# EAGLE design Interface Board v1.2 (EAGLE 9.5.1)
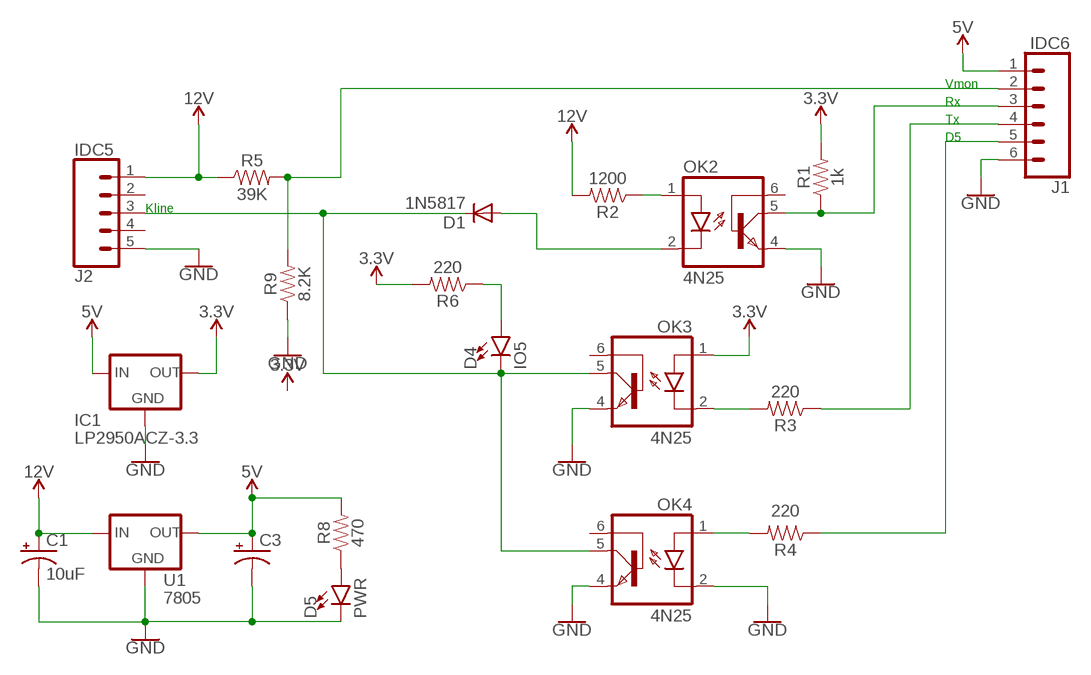
[diagram p0: schematic, sheet 1]

## Parts
C1  10uF  10UF-POLAR-RADIAL-2.5MM-25V-20%  [CPOL-RADIAL-2.5MM-5MM]
C3  10uF  10UF-POLAR-RADIAL-2.5MM-25V-20%  [CPOL-RADIAL-2.5MM-5MM]
D1  1N5817  1N4004  [DO41-10]
D4  IO5  LED5MM  [LED_5MM]
D5  PWR  LED5MM  [LED_5MM]
IC1  LP2950ACZ-3.3  [TO92]
J1  IDC6  CONN_06LONGPADS  [1X06_LONGPADS]
J2  IDC5  CONN_05  [1X05]
OK2  4N25  4N35  [DIL06]
OK3  4N25  4N35  [DIL06]
OK4  4N25  4N35  [DIL06]
R1  1k  1KOHM-HORIZ-1/4W-1%  [AXIAL-0.3]
R2  1200  1KOHM-HORIZ-1/4W-1%  [AXIAL-0.3]
R3  220  1KOHM-HORIZ-1/4W-1%  [AXIAL-0.3]
R4  220  1KOHM-HORIZ-1/4W-1%  [AXIAL-0.3]
R5  39K  1KOHM-HORIZ-1/4W-1%  [AXIAL-0.3]
R6  220  1KOHM-HORIZ-1/4W-1%  [AXIAL-0.3]
R8  470  1KOHM-HORIZ-1/4W-1%  [AXIAL-0.3]
R9  8.2K  1KOHM-HORIZ-1/4W-1%  [AXIAL-0.3]
U1  7805  V_REG_78XX-TO-220  [TO-220-ALT]

## Nets
3.3V: IC1.1(OUT) OK3.1(A) R1.P$2 R6.P$2
5V: C3.1(+) IC1.3(IN) J1.1 R8.P$2 U1.OUT
12V: C1.1(+) J2.1 R2.P$2 R5.P$1 U1.IN
GND: C1.2(-) C3.2(-) D5.K(C) IC1.2(GND) J1.6 J2.5 OK2.4(EMI) OK3.4(EMI) OK4.2(C) OK4.4(EMI) R9.P$1 U1.GND
KLINE: D1.C D4.K(C) J2.3 OK3.5(COL) OK4.5(COL)
N$1: OK3.2(C) R3.P$2
N$2: J1.4 R3.P$1
N$3: D1.A OK2.2(C)
N$5: D4.A R6.P$1
N$7: J1.3 OK2.5(COL) R1.P$1
N$8: OK2.1(A) R2.P$1
N$9: D5.A R8.P$1
N$10: J1.5 R4.P$1
N$11: OK4.1(A) R4.P$2
VMON: J1.2 R5.P$2 R9.P$2
Unconnected: J2.2 J2.4 OK2.6(BAS) OK3.6(BAS) OK4.6(BAS)

## Notes on the sheet
- Vmon
- Rx
- Tx
- D5
- Kline

## Library data of the parts
C1 C3 = SparkFun-Capacitors:10UF-POLAR: 10.0µF polarized capacitors A capacitor is a passive two-terminal electrical component used to store electrical energy temporarily in an electric field.; PROD_ID: CAP-08440
D1 = adafruit:1N4004: DIODE General purpose 1N400x type rectifier (With bigger pads) http://www.ladyada.net/library/pcb/eaglelibrary.html
D4 D5 = Modified-SF-LED-RGB-CA:LED: LED (Generic) Standard schematic elements and footprints for 5mm, 3mm, 1206, and 0603 sized LEDs. Generic LEDs with no color specified.
IC1 = v-reg:LP2950?*: Source: http://cache.national.com/ds/LP/LP2950.pdf
J1 = SparkFun-Connectors:CONN_06: Multi connection point. Often used as Generic Header-pin footprint for 0.1 inch spaced/style header connections On any of the 0.1 inch spaced packages, you can populate with these: Break Away Headers - Straight <https://www.sparkfun.com/products/116> (PRT-00116) Break Away Male Headers - Right Angle <https://www.sparkfun.com/products/553> (PRT-00553) Female Headers <https://www.sparkfun.com/products/115> (PRT-00115) Break Away Headers - Machine Pin <https://www.sparkfun.com/products/117> (PRT-00117) Break Away Female Headers - Swiss Machine Pin <https://www.sparkfun.com/products/743> (PRT-00743) Arduino Stackable Header - 6 Pin <https://www.sparkfun.com/products/9280> (PRT-09280) For SCREWTERMINALS and SPRING TERMINALS visit here: Screw Terimnals on SparkFun.com <https://www.sparkfun.com/search/results?term=Screw+Terminals> (5mm/3.5mm/2.54mm spacing) This device is also useful as a general connection point to wire up your design to another part of your project. Our various solder wires solder well into these plated through hole pads. Hook-Up Wire - Assortment (Stranded, 22 AWG) <https://www.sparkfun.com/products/11375> (PRT-11375) Hook-Up Wire - Assortment (Solid Core, 22 AWG) <https://www.sparkfun.com/products/11367> (PRT-11367) View the entire wire category on our website here <https://www.sparkfun.com/categories/141>
J2 = SparkFun-Connectors:CONN_05: Multi connection point. Often used as Generic Header-pin footprint for 0.1 inch spaced/style header connections On any of the 0.1 inch spaced packages, you can populate with these: Break Away Headers - Straight <https://www.sparkfun.com/products/116> (PRT-00116) Break Away Male Headers - Right Angle <https://www.sparkfun.com/products/553> (PRT-00553) Female Headers <https://www.sparkfun.com/products/115> (PRT-00115) Break Away Headers - Machine Pin <https://www.sparkfun.com/products/117> (PRT-00117) Break Away Female Headers - Swiss Machine Pin <https://www.sparkfun.com/products/743> (PRT-00743) For SCREWTERMINALS and SPRING TERMINALS visit here: Screw Terimnals on SparkFun.com <https://www.sparkfun.com/search/results?term=Screw+Terminals> (5mm/3.5mm/2.54mm spacing) This device is also useful as a general connection point to wire up your design to another part of your project. Our various solder wires solder well into these plated through hole pads. Hook-Up Wire - Assortment (Stranded, 22 AWG) <https://www.sparkfun.com/products/11375> (PRT-11375) Hook-Up Wire - Assortment (Solid Core, 22 AWG) <https://www.sparkfun.com/products/11367> (PRT-11367) View the entire wire category on our website here <https://www.sparkfun.com/categories/141> Special notes: Molex polarized connector foot print use with SKU : PRT-08231 with associated crimp pins and housings. 1MM SMD Version SKU: PRT-10208
OK2-OK4 = optocoupler:4N35: MOTOROLA OPTO COUPLER; MF: FAIRCHILD SEMICONDUCTOR; MPN: 4N35; OC_FARNELL: 1328375; OC_NEWARK: 72K9946
R1 = SparkFun-Resistors:1KOHM: 1kΩ resistor A resistor is a passive two-terminal electrical component that implements electrical resistance as a circuit element. Resistors act to reduce current flow, and, at the same time, act to lower voltage levels within circuits. - Wikipedia; PROD_ID: RES-12182
R2-R6 R8 R9 = SparkFun-Resistors:1KOHM: 1kΩ resistor A resistor is a passive two-terminal electrical component that implements electrical resistance as a circuit element. Resistors act to reduce current flow, and, at the same time, act to lower voltage levels within circuits. - Wikipedia; PROD_ID: RES-12182; VALUE: 1k
U1 = SparkFun-IC-Power:V_REG_78XX: Voltage Regulator Standard 78xx regulator. IGO (Input Ground Output). Spark Fun Electronics SKU : COM-00107; PROD_ID: VREG-08450; SF_ID: COM-00107

## Board
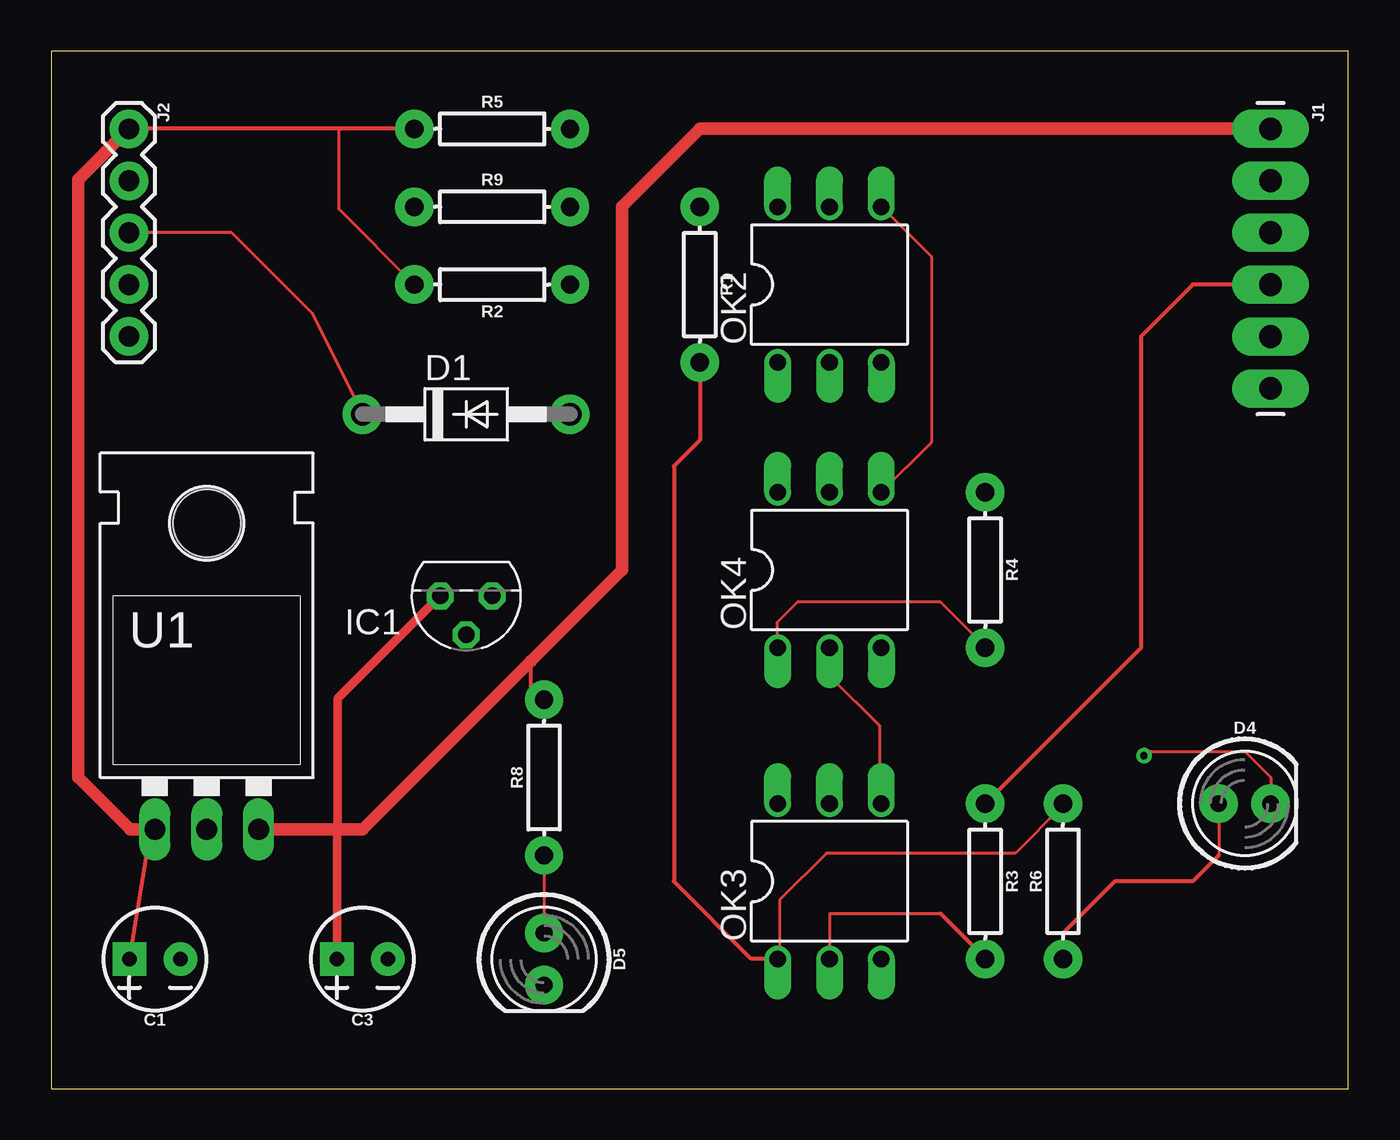
[diagram p1: board, top side]
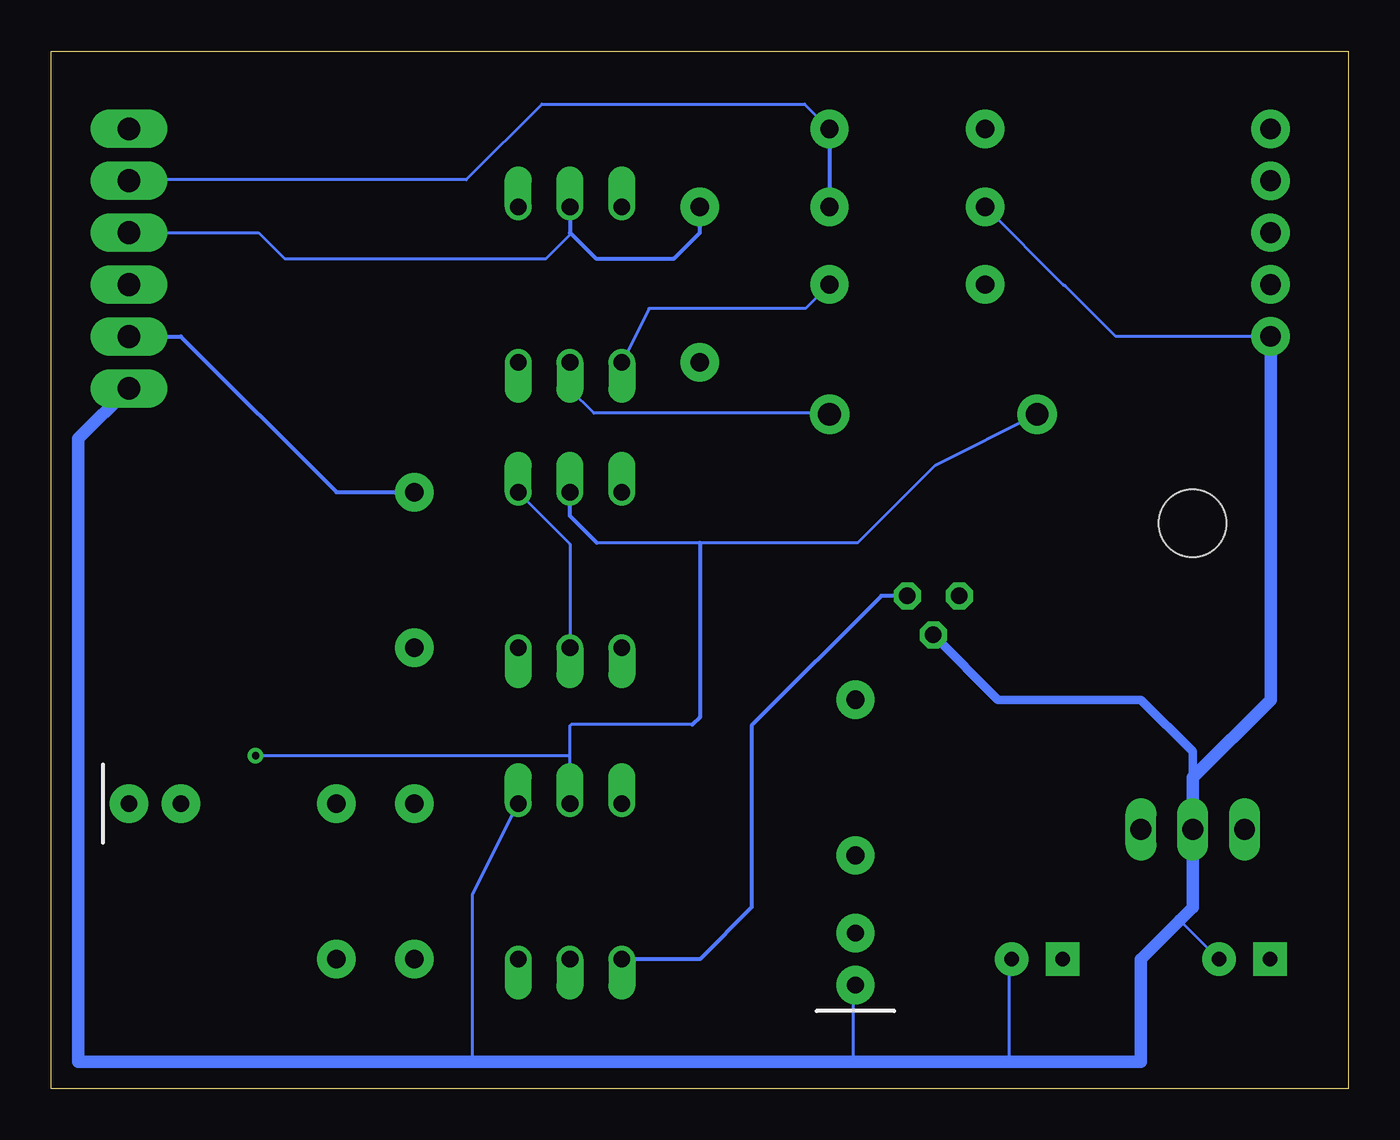
[diagram p2: board, bottom side, seen from below]

Size 63.5 x 50.8 mm. Coordinates in mm from the lower left corner, seen from the top.
Outline: 0,0 63.5,0 63.5,50.8 0,50.8 0,0
Copper layers (1*16): Top 0.035mm / dielectric 1.5mm / Bottom 0.035mm
Design rules "default": minimum track width 6mil, minimum drill 0.35mm, track to track 6mil, track to pad 6mil, pad to pad 6mil, via to via 6mil, smd to smd 6mil, copper to edge 40mil, drill to drill 6mil, minimum pad ring 10mil, minimum via ring 8mil, stop-mask expansion 4mil, vias tented up to drill 0mil, thermal gap 10mil

### Footprints (pad centres in the part's own frame; a part is rotated, then mirrored left to right if it is on the bottom)
CPOL-RADIAL-2.5MM-5MM = drill 0.7 pad 1.651 square: 1 1.25,0 | drill 0.7 pad 1.651: 2 -1.25,0
DO41-10 = drill 1.118 pad 1.93: A 5.08,0; C -5.08,0
LED_5MM = drill 0.813 pad 1.88: A -1.27,0; K 1.27,0
TO92 = drill 0.813 octagon: 1 -1.27,0; 2 0,1.905; 3 1.27,0
1X06_LONGPADS = drill 1.118 pad 1.88 long: 1 0,0; 2 2.54,0; 3 5.08,0; 4 7.62,0; 5 10.16,0; 6 12.7,0
1X05 = drill 1.016 pad 1.88: 1 0,0; 2 2.54,0; 3 5.08,0; 4 7.62,0; 5 10.16,0
DIL06 = drill 0.813 offset: 1 -2.54,-3.81; 2 0,-3.81; 3 2.54,-3.81; 4 2.54,3.81; 5 0,3.81; 6 -2.54,3.81
AXIAL-0.3 = drill 0.9 pad 1.88: P$1 -3.81,0; P$2 3.81,0
TO-220-ALT = drill 1.016 long: GND 0,-3.81; IN -2.54,-3.81; OUT 2.54,-3.81 | hole 3.302: 0,11.176

### Placement (x,y rotation side)
C1  5.08,6.35 180 top
C3  15.24,6.35 180 top
D1  20.32,33.02 0 top
D4  58.42,13.97 0 top
D5  24.13,6.35 270 top
IC1  20.32,24.13 180 top
J1  59.69,46.99 270 top
J2  3.81,46.99 270 top
OK2  38.1,39.37 0 top
OK3  38.1,10.16 0 top
OK4  38.1,25.4 0 top
R1  31.75,39.37 270 top
R2  21.59,39.37 180 top
R3  45.72,10.16 270 top
R4  45.72,25.4 270 top
R5  21.59,46.99 0 top
R6  49.53,10.16 90 top
R8  24.13,15.24 90 top
R9  21.59,43.18 0 top
U1  7.62,16.51 0 top

### Tracks (layer width: path | path; a pad name or v marks a point on that pad's centre or on a via)
3.3V
  Top 0.152: OK3.1 35.66,6.4 35.66,9.25 37.95,11.53 47.19,11.53 49.53,13.87 R6.P$2
  Top 0.203: R1.P$2 31.75,31.75 30.48,30.48 30.48,10.16 34.24,6.4 35.66,6.4
  Bottom 0.203: IC1.1 22.86,24.13 29.21,17.78 29.21,8.89 31.75,6.35 OK3.1
5V
  Top 0.203: R8.P$2 23.5,19.68 23.5,20.95
  Top 0.406: IC1.3 14.02,19.1 14.02,12.7 13.99,12.67 C3.1
  Top 0.61: J1.1 31.75,46.99 27.94,43.18 27.94,25.4 23.5,20.95 15.24,12.7 14.02,12.7 U1.OUT
12V
  Top 0.152: R2.P$2 14.07,43.08 14.07,46.99
  Top 0.203: R5.P$1 14.07,46.99 J2.1 | U1.IN 4.83,12.45 C1.1
  Top 0.61: J2.1 1.32,44.5 1.32,15.24 3.86,12.7 U1.IN
GND
  Top 0.152: OK3.4 40.54,14.02 40.54,17.78 38.1,20.22 OK4.2 | OK2.4 43.08,40.74 43.08,31.65 OK4.4
  Bottom 0.152: OK4.2 38.1,26.67 OK4.4 | J2.5 11.38,36.83 13.87,39.32 13.97,39.37 R9.P$1 | 42.88,1.32 42.88,9.5 OK3.4 | 24.23,1.32 24.23,5.08 D5.K | 8.26,8.26 6.4,6.4 C1.2 | 16.61,1.32 16.61,6.25 C3.2
  Bottom 0.406: IC1.2 17.14,19.05 10.16,19.05 7.62,16.51 7.62,15.24
  Bottom 0.61: J1.6 62.16,31.82 62.16,1.32 42.88,1.32 24.23,1.32 16.61,1.32 10.16,1.32 10.16,6.35 8.26,8.26 7.62,8.89 U1.GND 7.62,15.24 3.81,19.05 J2.5
KLINE  (via drill 0.35)
  Top 0.152: J2.3 8.84,41.91 12.75,38 D1.C | v53.49,16.31 53.7,16.51 58.42,16.51 59.69,15.24 D4.K
  Bottom 0.152: OK3.5 38.1,16.31 | 38.1,16.31 38.1,17.78 38.05,17.83 32.11,17.83 | 36.78,26.72 31.75,26.72 24.03,26.72 20.22,30.53 D1.C | 38.1,16.31 v53.49,16.31
  Bottom 0.203: 36.78,26.72 38.1,28.04 OK4.5 | 32.11,17.83 31.75,18.19 31.75,26.72
N$1
  Top 0.152: 43.54,8.59 38.1,8.59 OK3.2
  Top 0.203: 43.54,8.59 45.72,6.4 R3.P$2
N$2
  Top 0.203: J1.4 55.88,39.37 53.34,36.83 53.34,21.59 R3.P$1
N$3
  Bottom 0.152: OK2.2 38.1,34.24 36.93,33.07 25.5,33.07 D1.A
N$5
  Top 0.152: D4.A 57.15,11.43
  Top 0.203: 57.15,11.43 55.88,10.16 52.07,10.16 49.53,7.62 R6.P$1
N$7
  Bottom 0.152: OK2.5 38.1,41.81 39.27,40.64 52.07,40.64 53.34,41.91 J1.3
  Bottom 0.203: OK2.5 38.1,41.91 36.83,40.64 33.02,40.64 31.75,41.91 R1.P$1
N$8
  Bottom 0.152: R2.P$1 26.57,38.2 34.24,38.2 OK2.1
N$9
  Top 0.152: R8.P$1 D5.A
N$10
  Bottom 0.203: J1.5 57.15,36.83 49.53,29.21 R4.P$1
N$11
  Top 0.152: OK4.1 35.56,22.86 36.52,23.82 43.54,23.82 45.72,21.64 R4.P$2
VMON
  Bottom 0.152: R5.P$2 26.62,48.21 39.47,48.21 43.18,44.5 59.59,44.5 J1.2
  Bottom 0.203: R5.P$2 R9.P$2